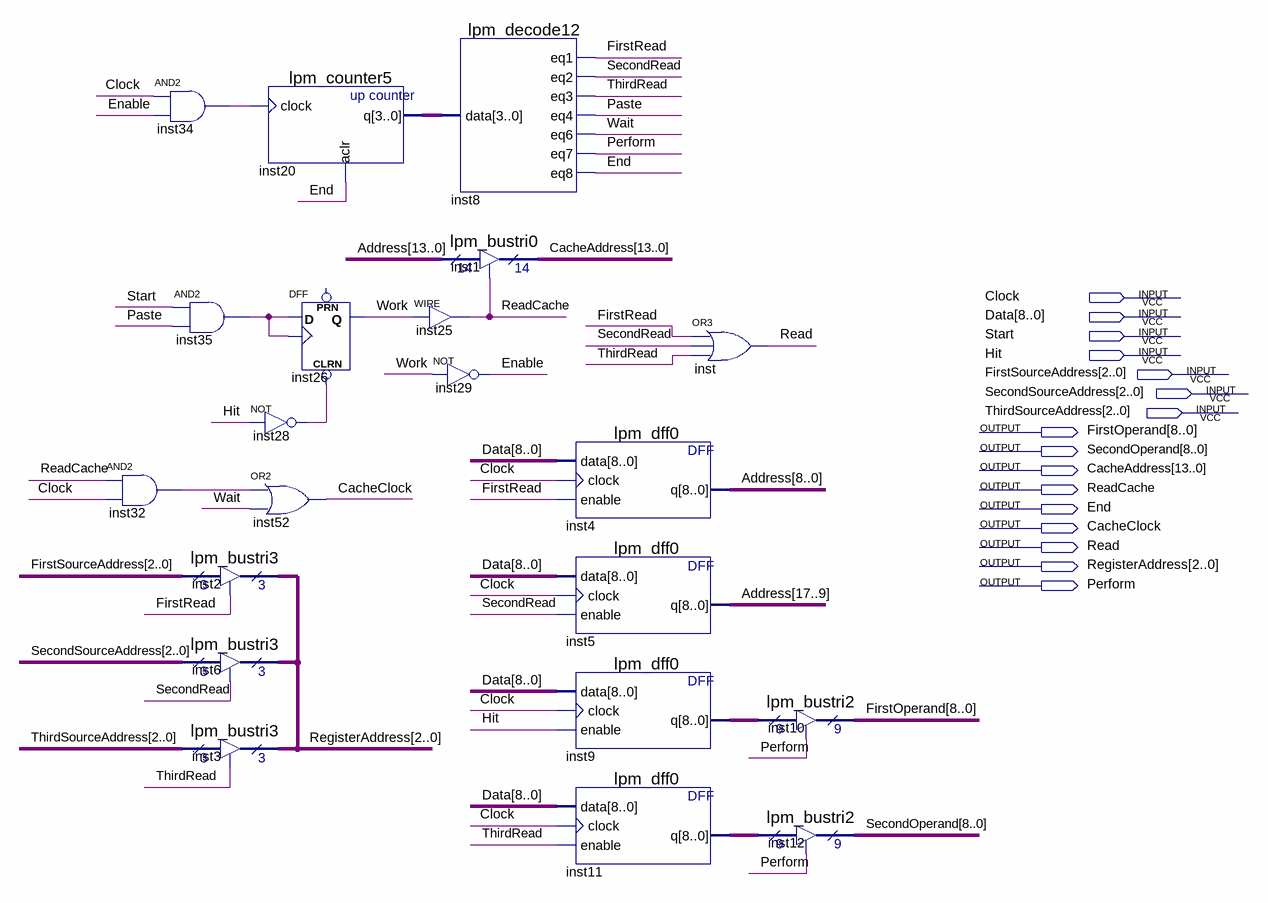
[diagram p0: schematic sheet]
// Quartus schematic SubRegisterBlock.bdf as structural Verilog: 21 symbols, 16 pins
module SubRegisterBlock (
  input  Clock,
  input  [8:0] Data,
  input  Start,
  input  Hit,
  input  [2:0] FirstSourceAddress,
  input  [2:0] SecondSourceAddress,
  input  [2:0] ThirdSourceAddress,
  output [8:0] FirstOperand,
  output [8:0] SecondOperand,
  output [13:0] CacheAddress,
  output ReadCache,
  output End,
  output CacheClock,
  output Read,
  output [2:0] RegisterAddress,
  output Perform
);

  wire Enable, FirstRead, inst28_out, inst32_out, inst34_out, inst35_out, Paste, SecondRead, ThirdRead, Wait,
       Work;
  wire [3:0] inst20_q;
  wire [8:0] inst9_q, inst11_q;
  wire [17:0] Address;

  and inst32 (inst32_out, ReadCache, Clock);
  and inst34 (inst34_out, Clock, Enable);
  and inst35 (inst35_out, Start, Paste);
  lpm_bustri3 inst2 (.enabledt(FirstRead), .data(FirstSourceAddress), .tridata(RegisterAddress));
  lpm_bustri3 inst6 (.enabledt(SecondRead), .data(SecondSourceAddress), .tridata(RegisterAddress));
  lpm_bustri3 inst3 (.enabledt(ThirdRead), .data(ThirdSourceAddress), .tridata(RegisterAddress));
  lpm_counter5 inst20 (.clock(inst34_out), .aclr(End), .q(inst20_q));
  DFF inst26 (.CLRN(inst28_out), .CLK(inst35_out), .D(inst35_out), .Q(Work));  // open: PRN
  not inst28 (inst28_out, Hit);
  or inst52 (CacheClock, inst32_out, Wait);
  lpm_decode12 inst8 (
    .data(inst20_q), .eq1(FirstRead), .eq2(SecondRead), .eq3(ThirdRead), .eq4(Paste), .eq6(Wait),
    .eq7(Perform), .eq8(End));
  lpm_bustri0 inst1 (.enabledt(ReadCache), .data(Address[13:0]), .tridata(CacheAddress));
  assign ReadCache = Work;  // WIRE inst25
  not inst29 (Enable, Work);
  lpm_dff0 inst4 (.data(Data), .clock(Clock), .enable(FirstRead), .q(Address[8:0]));
  lpm_dff0 inst5 (.data(Data), .clock(Clock), .enable(SecondRead), .q(Address[17:9]));
  lpm_dff0 inst9 (.data(Data), .clock(Clock), .enable(Hit), .q(inst9_q));
  lpm_dff0 inst11 (.data(Data), .clock(Clock), .enable(ThirdRead), .q(inst11_q));
  or inst (Read, FirstRead, SecondRead, ThirdRead);
  lpm_bustri2 inst10 (.enabledt(Perform), .data(inst9_q), .tridata(FirstOperand));
  lpm_bustri2 inst12 (.enabledt(Perform), .data(inst11_q), .tridata(SecondOperand));
endmodule
